# EAGLE schematic SimpleShield (EAGLE 7.7.0)
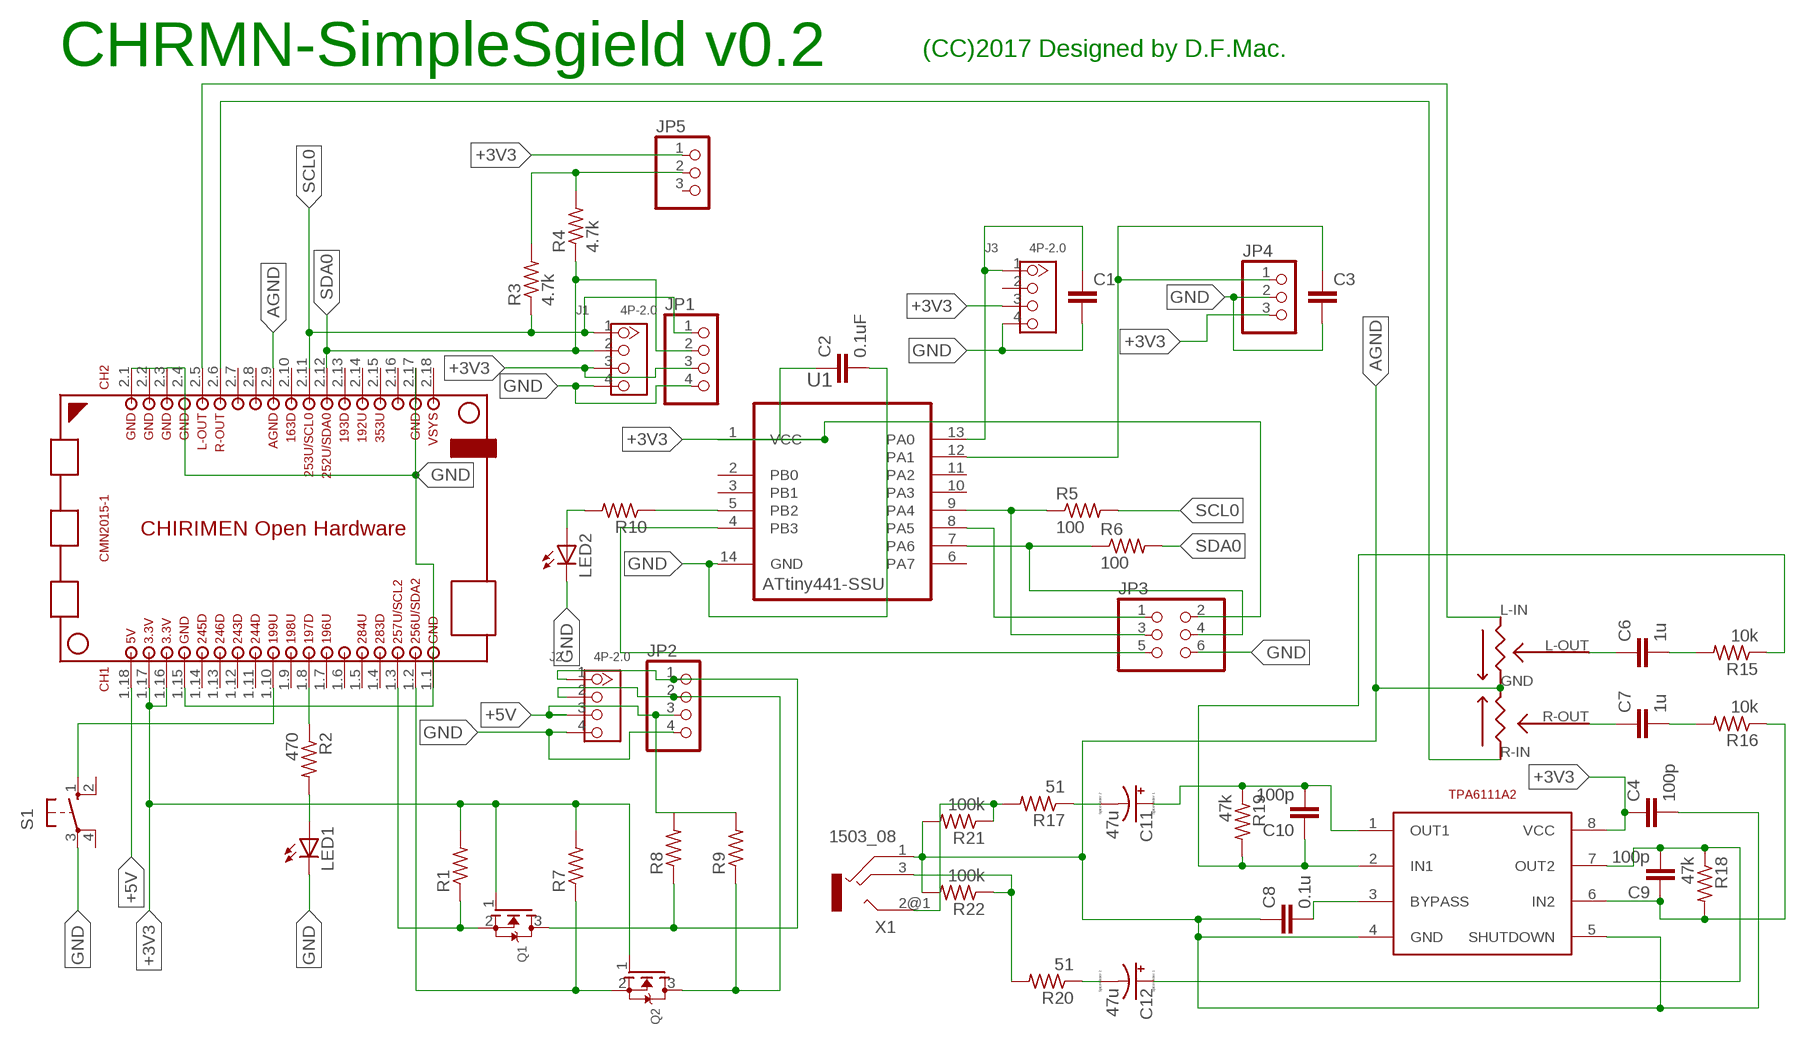
[diagram p0: schematic, sheet 1]

## Parts
C1  C-EUC0805  [C0805]
C2  0.1uF  C-EUC0805  [C0805]
C3  C-EUC0805  [C0805]
C4  100p  C-EUC0603K  [C0603K]
C6  1u  C-EUC0603K  [C0603K]
C7  1u  C-EUC0603K  [C0603K]
C8  0.1u  C-EUC0603K  [C0603K]
C9  100p  C-EUC0603K  [C0603K]
C10  100p  C-EUC0603K  [C0603K]
C11  47u  CPOL-US153CLV-0605  [153CLV-0605]
C12  47u  CPOL-US153CLV-0605  [153CLV-0605]
J1  4P-2.0  GROVE-CONNECTOR-DIP(4P-2.0)  [HW4-2.0]
J2  4P-2.0  GROVE-CONNECTOR-DIP(4P-2.0)  [HW4-2.0]
J3  4P-2.0  GROVE-CONNECTOR-DIP(4P-2.0)  [HW4-2.0]
JP1  PINHD-1X4  [1X04]
JP2  PINHD-1X4  [1X04]
JP3  PINHD-2X3  [2X03]
JP4  PINHD-1X3  [1X03]
JP5  PINHD-1X3  [1X03]
LED1  LED3MM  [LED3MM]
LED2  LED3MM  [LED3MM]
Q1  MOSFET-NREFLOW  [SOT23]
Q2  MOSFET-NREFLOW  [SOT23]
R1  R-US_R0603  [R0603]
R2  470  R-US_R0603  [R0603]
R3  4.7k  R-US_R0603  [R0603]
R4  4.7k  R-US_R0603  [R0603]
R5  100  R-US_R0603  [R0603]
R6  100  R-US_R0603  [R0603]
R7  R-US_R0603  [R0603]
R8  R-US_R0603  [R0603]
R9  R-US_R0603  [R0603]
R10  R-US_R0603  [R0603]
R15  10k  R-US_R0603  [R0603]
R16  10k  R-US_R0603  [R0603]
R17  51  R-US_R0603  [R0603]
R18  47k  R-US_R0603  [R0603]
R19  47k  R-US_R0603  [R0603]
R20  51  R-US_R0603  [R0603]
R21  100k  R-US_R0603  [R0603]
R22  100k  R-US_R0603  [R0603]
S1  10-XX  [B3F-10XX]
U1  ATTINY44A-SSU  [SOIC127P600X175-14N]
U$1  CMN2015-1SMALL  [CHMN2015-1-SMALL]
U$4  5PIN-RADIO-POT  [5PIN-RADIO-POT]
U$5  TPA6111A2  [MSOP8]
X1  1503_08  [1503_08]

## Nets
+3V3: C2.1 C4.1 J1.3 J3.3 JP1.3 JP3.2 JP4.3 JP5.1 Q1.1(G) Q2.1(G) R1.2 R7.2 U1.1(VCC) U$1.1.16(CH1-16) U$1.1.17(CH1-17) U$5.8(VCC)
+5V: J2.3 JP2.3 R8.2 R9.2 U$1.1.18(CH1-18)
AGND: C4.2 C8.1 R21.2 R22.2 U$1.2.9(CH2-9) U$4.GND U$5.4(GND) U$5.5(SHUTDOWN) X1.1(GND)
GND: C1.2 C2.2 C3.2 J1.4 J2.4 J3.4 JP1.4 JP2.4 JP3.6 JP4.2 LED1.K(C) LED2.K(C) S1.3(P) U1.14(GND) U$1.1.1(CH1-1) U$1.1.15(CH1-15) U$1.2.1(CH2-1) U$1.2.2(CH2-2) U$1.2.3(CH2-3) U$1.2.4(CH2-4) U$1.2.17(CH2-17)
N$1: LED1.A R2.2
N$2: R2.1 U$1.1.8(CH1-8)
N$3: S1.1(S) U$1.1.10(CH1-10)
N$4: JP3.1 U1.8(PA5)
N$5: JP3.3 R5.1 U1.9(PA4)
N$6: JP3.5 U1.4(PB3)
N$7: JP3.4 R6.1 U1.7(PA6)
N$8: C1.1 J3.1 U1.13(PA0)
N$9: J2.1 JP2.1 Q1.3(D) R8.1
N$10: J2.2 JP2.2 Q2.3(D) R9.1
N$11: C3.1 JP4.1 U1.12(PA1)
N$14: R10.1 U1.5(PB2)
N$15: LED2.A R10.2
N$17: JP5.2 R3.2 R4.2
N$39: R17.2 R21.1 X1.2@1(L)
N$40: U$1.2.5(CH2-5) U$4.L-IN(IN-L)
N$41: U$1.2.6(CH2-6) U$4.R-IN(IN-R)
N$42: C6.1 U$4.L-OUT(OUT-L)
N$43: C7.1 U$4.R-OUT(OUT-R)
N$44: C6.2 R15.2
N$45: C7.2 R16.2
N$46: C10.1 R15.1 R19.2 U$5.2(IN1)
N$47: C9.1 R16.1 R18.2 U$5.6(IN2)
N$48: C11.- R17.1
N$49: C8.2 U$5.3(BYPASS)
N$50: C9.2 C12.+ R18.1 U$5.7(OUT2)
N$51: C10.2 C11.+ R19.1 U$5.1(OUT1)
N$53: R20.2 R22.1 X1.3(R)
N$54: C12.- R20.1
SCL0: J1.1 JP1.1 R3.1 R5.2 U$1.2.11(CH2-11)
SCL2: Q1.2(S) R1.1 U$1.1.3(CH1-3)
SDA0: J1.2 JP1.2 R4.1 R6.2 U$1.2.12(CH2-12)
SDA2: Q2.2(S) R7.1 U$1.1.2(CH1-2)
Unconnected: J3.2 JP5.3 S1.2(S1) S1.4(P1) U1.2(PB0) U1.3(PB1) U1.6(PA7) U1.10(PA3) U1.11(PA2) U$1.1.4(CH1-4) U$1.1.5(CH1-5) U$1.1.6(CH1-6) U$1.1.7(CH1-7) U$1.1.9(CH1-9) U$1.1.11(CH1-11) U$1.1.12(CH1-12) U$1.1.13(CH1-13) U$1.1.14(CH1-14) U$1.2.7(CH2-7) U$1.2.8(CH2-8) U$1.2.10(CH2-10) U$1.2.13(CH2-13) U$1.2.14(CH2-14) U$1.2.15(CH2-15) U$1.2.16(CH2-16) U$1.2.18(CH2-18) U$1.O1(HOLE1) U$1.O2(HOLE2) X1.2@2

## Notes on the sheet
- (CC)2017 Designed by D.F.Mac.
- CHRMN-SimpleSgield v0.2
- ATtiny441-SSU

## Library data of the parts
C1-C3 = 0my:C-EU: CAPACITOR, European symbol
C4 C6-C10 = resistor:C-EU: CAPACITOR, European symbol
C11 C12 = 0my:CPOL-US: POLARIZED CAPACITOR, American symbol
J1-J3 = Seeed-OPL-Connector:GROVE-CONNECTOR-DIP(4P-2.0): 320110033
JP1 JP2 = 0my:PINHD-1X4: PIN HEADER
JP3 = 0my:PINHD-2X3: PIN HEADER
JP4 JP5 = 0my:PINHD-1X3: PIN HEADER
LED1 LED2 = led:LED: LED OSRAM: - CHIPLED LG R971, LG N971, LY N971, LG Q971, LY Q971, LO R971, LY R971 LH N974, LH R974 LS Q976, LO Q976, LY Q976 LO Q996 - Hyper CHIPLED LW Q18S LB Q993, LB Q99A, LB R99A - SideLED LS A670, LO A670, LY A670, LG A670, LP A670 LB A673, LV A673, LT A673, LW A673 LH A674 LY A675 LS A676, LA A676, LO A676, LY A676, LW A676 LS A679, LY A679, LG A679 - Hyper Micro SIDELED® LS Y876, LA Y876, LO Y876, LY Y876 LT Y87S - SmartLED LW L88C, LW L88S LB L89C, LB L89S, LG L890 LS L89K, LO L89K, LY L89K LS L896, LA L896, LO L896, LY L896 - TOPLED LS T670, LO T670, LY T670, LG T670, LP T670 LSG T670, LSP T670, LSY T670, LOP T670, LYG T670 LG T671, LOG T671, LSG T671 LB T673, LV T673, LT T673, LW T673 LH T674 LS T676, LA T676, LO T676, LY T676, LB T676, LH T676, LSB T676, LW T676 LB T67C, LV T67C, LT T67C, LS T67K, LO T67K, LY T67K, LW E67C LS E67B, LA E67B, LO E67B, LY E67B, LB E67C, LV E67C, LT E67C LW T67C LS T679, LY T679, LG T679 LS T770, LO T770, LY T770, LG T770, LP T770 LB T773, LV T773, LT T773, LW T773 LH T774 LS E675, LA E675, LY E675, LS T675 LS T776, LA T776, LO T776, LY T776, LB T776 LHGB T686 LT T68C, LB T68C - Hyper Mini TOPLED® LB M676 - Mini TOPLED Santana® LG M470 LS M47K, LO M47K, LY M47K Source: http://www.osram.convergy.de LUXEON: - LUMILED® LXK2-PW12-R00, LXK2-PW12-S00, LXK2-PW14-U00, LXK2-PW14-V00 LXK2-PM12-R00, LXK2-PM12-S00, LXK2-PM14-U00 LXK2-PE12-Q00, LXK2-PE12-R00, LXK2-PE12-S00, LXK2-PE14-T00, LXK2-PE14-U00 LXK2-PB12-K00, LXK2-PB12-L00, LXK2-PB12-M00, LXK2-PB14-N00, LXK2-PB14-P00, LXK2-PB14-Q00 LXK2-PR12-L00, LXK2-PR12-M00, LXK2-PR14-Q00, LXK2-PR14-R00 LXK2-PD12-Q00, LXK2-PD12-R00, LXK2-PD12-S00 LXK2-PH12-R00, LXK2-PH12-S00 LXK2-PL12-P00, LXK2-PL12-Q00, LXK2-PL12-R00 Source: www.luxeon.com KINGBRIGHT: KA-3528ASYC Source: www.kingbright.com
Q1 Q2 = adafruit:MOSFET-N: N-Channel Mosfet 2N7002E - 60V 260mA SOT23 [Digikey: 2N7002ET1GOSTR-ND] - REEL BSH103 - 30V 850mA SOT23 [Digikey: 568-5013-1-ND]
R1-R10 R15-R22 = 0my:R-US_: RESISTOR, American symbol
S1 = 0my:10-XX: OMRON SWITCH; MPN: B3F-1000; OC_FARNELL: 176432; OC_NEWARK: 36M3542
U1 = Atmel_By_element14_Batch_1-00:ATTINY44A-SSU: 8-bit Microcontroller with In-System Programmable Flash; MPN: ATTINY44A-SSU; OC_FARNELL: 1699397; OC_NEWARK: 80P3683; PACKAGE: SOIC-14; SUPPLIER: Atmel
U$1 = 0-chirimen:CMN2015-1: CHIRIMEN CMN2015-1 Web Site <https://chirimen.org/>
U$4 = 0-cheen:5PIN-RADIO-POT
U$5 = 0-cheen:TPA6111A2
X1 = 0my:1503_?: Jack connectors according to JISC 6560, 3.5 mm Klinkensteckverbinder nach JISC 6560, 3,5 mm Source: http://www.lumberg.com/Produkte/PDFs/1503_08.pdf; OC_FARNELL: unknown; OC_NEWARK: unknown

## Net classes
0 default: width 0.406 mm, drill 0.305 mm, clearance 0.305 mm
2 GND: width 0.813 mm, drill 0.61 mm, clearance 0.406 mm